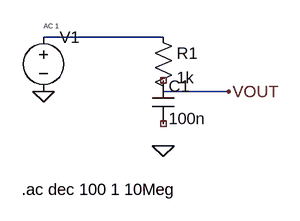
[diagram p0: schematic rc_sinus_frequentiel.asc]
rc_sinus_frequentiel.asc, the LTspice schematic file:
Version 4
SHEET 1 880 680
WIRE 80 96 256 96
WIRE 256 176 352 176
FLAG 80 176 0
FLAG 256 256 0
FLAG 352 176 VOUT
SYMBOL voltage 80 80 R0
WINDOW 123 0 0 Left 0
WINDOW 39 0 0 Left 0
SYMATTR InstName V1
SYMATTR Value ""
SYMATTR SpiceLine AC 1
SYMBOL res 240 80 R0
SYMATTR InstName R1
SYMATTR Value 1k
SYMBOL cap 240 160 R0
SYMATTR InstName C1
SYMATTR Value 100n
TEXT 48 320 Left 2 !.ac dec 100 1 10Meg

The netlist it stands for:
* rc_sinus_frequentiel.asc
V1 N001 0 AC 1
R1 N001 VOUT 1k
C1 NC_01 NC_02 100n
.ac dec 100 1 10Meg
.backanno
.end